# Altium schematic sheet Step Down.schdoc
size 223 x 139 mm; SheetNumber: 1; SheetTotal: 1
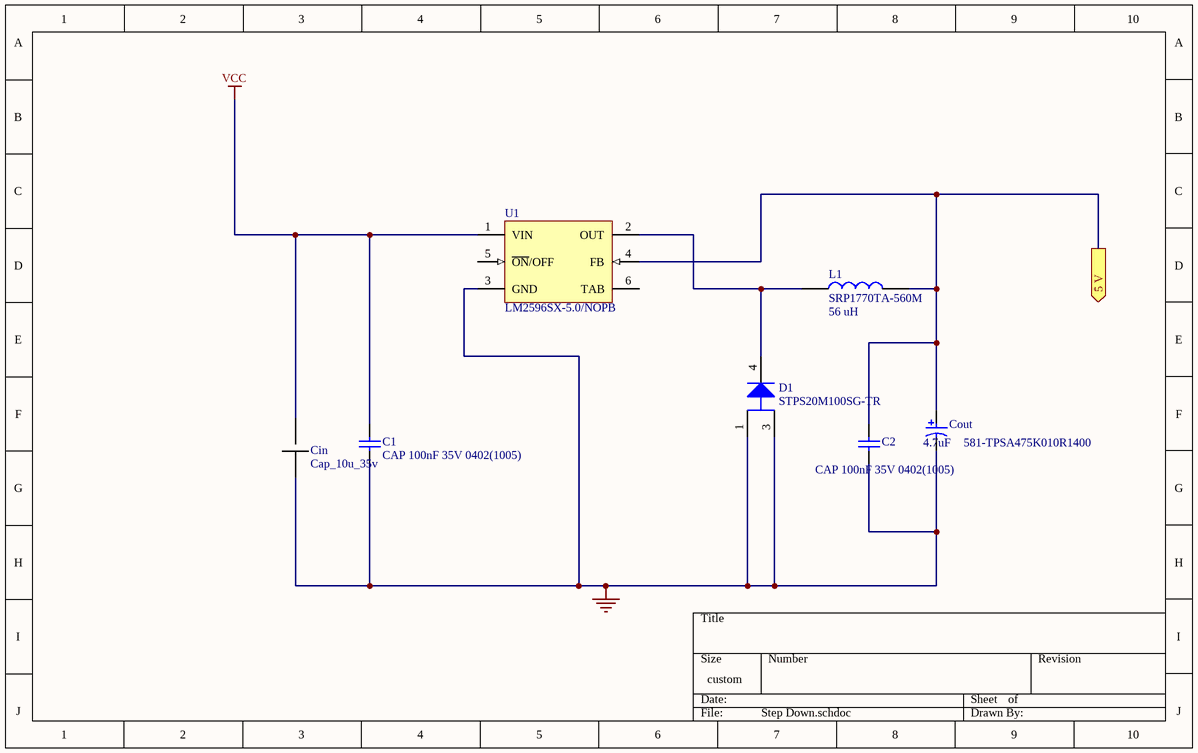
[diagram p0: Step Down.schdoc]

## Parts
C1  CAP 100nF 35V 0402(1005)  [CAPC0402(1005)60_N]
C2  CAP 100nF 35V 0402(1005)  [CAPC0402(1005)60_N]
Cin  Cap_10u_35v  [CAP POL 2917/7343]
Cout  581-TPSA475K010R1400  Capacitancia: 4.7uF  [AVX-TAJ-A-2_L]
D1  STPS20M100SG-TR  [ONSC-D2PAK-3-418B-04_J_V]
L1  SRP1770TA-560M  Indutancia: 56 uH  [INDPM173169X700N]
U1  LM2596SX-5.0/NOPB  [TS5B_M]

## Ports
5 V (out)

## Nets
0: C1.1 C2.1 Cin.1 Cout.2 D1.1(A) D1.3(A) U1.3(GND)
VCC: C1.2 Cin.2 U1.1(VIN)
5 V: C2.2 Cout.1 L1.2 U1.4(FB) ; port 5 V
NetD1_4: D1.4(K) L1.1 U1.2(OUT)

Not connected (* = marked no-connect by the designer): U1 5(~{ON}/OFF) 6(TAB)

## Library data of the parts
C1 = CMP-1034-02076-1: CAP 100nF 35V ±20% 0402 (1005 Metric) Thickness 0.6mm SMD                                                  963-GMK105BJ104MV-F; Case-Metric: 1005; Tolerance: Â±20%; Case-EIA: 0402; Rated Voltage: 35 V; Max Thickness: 0.6 mm; Value: 100nF; Technology: SMT
C2 = CMP-1034-02076-1: CAP 100nF 35V ±20% 0402 (1005 Metric) Thickness 0.6mm SMD                                                 963-GMK105BJ104MV-F; Case-Metric: 1005; Tolerance: Â±20%; Case-EIA: 0402; Rated Voltage: 35 V; Max Thickness: 0.6 mm; Value: 100nF; Technology: SMT
Cin = Cap_10u_35v: 80-T491D106M35AT7280
Cout = CMP-2100-03687-1: Standard Tantalum, 4.7 uF, +/- 10%, 10 V, -55 to 125 degC, 2-Pin SMD (1206), RoHS, Tape and Reel     581-TPSA475K010R1400; Manufacturer: AVX; Dissipation Factor: 6%; Voltage Rating: 10V; Polarity: Polar; Resistance: 4Ohm; Leakage Current: 800nA; Lead Free: LeadFree; Radiation Hardening: No; Depth: 1.6mm; Package Description: 2-Pin Surface Mount Device, Body 3.2 x 1.65 mm; Package Quantity: 1; Max Operating Temperature: 125degC; Case/Package: 1206; Min Operating Temperature: -55degC; Datasheet URL: https://br.mouser.com/datasheet/2/40/tps-776850.pdf; Termination: SMD/SMT; Length: 3.2mm; Height - Seated (Max): 0.071inch; Packaging: TapeandReel; Package Reference: TPS-A-475; RoHSCompliant: True; Datasheet Version: 42401.0; Voltage Rating (DC): 10V; REACH SVHC: NoSVHC; ESR (Equivalent Series Resistance): 4Ohm; Tolerance: 10%; Case Code (Metric): 3216; Voltage: 10V; Height: 1.6mm; Number of Pins: 2; Lead Pitch: 1.1mm; Dielectric Material: Tantalum; Case Code (Imperial): 1206; Width: 1.6mm; Capacitance: 4.7uF
D1 = CMP-1055-00080-1: SWITCHMODE(TM) Power Rectifier ORing Function Diode, 3-Pin D2PAK, Tape and Reel; Manufacturer: On Semiconductor; Configuration: Single; IFSM Max (A): 150; Voltagem: 455mV; PartNumber: STPS20M100SG-TR; PackageReference: D2PAK-3-418B-04_J; DatasheetVersion: Rev. 6; ComponentLink2URL: http://www.onsemi.cn/pub_link/Collateral/MBRB2515L-D.PDF; RoHS: FALSE; ComponentLink2Description: Datasheet; PackageDescription: 3-Pin D2PAK, Body 9.145 x 9.97 mm, Pitch 2.54 mm; ComponentLink1URL: http://www.onsemi.com/; Mounting Technology: Surface Mount; ComponentLink3Description: Package Specification; Packing: Tape and Reel; PackageVersion: Rev. J, 08/2004; ComponentLink1Description: Manufacturer URL; ComponentLink3URL: http://www.onsemi.com/pub_link/Collateral/BUB323Z-D.PDF
L1 = SRP1770TA-560M: Shielded Power Inductor SMD 56uH Bourns SRP1770TA Series Shielded Wire-wound SMD Inductor with a Carbonyl Powder Core, 56 H Wire-Wound 7.8A Idc Q:20; Geometry.Height: 7mm; Manufacturer_Part_Number: SRP1770TA-560M; RS Part Number: 9054781; RS Price/Stock: http://uk.rs-online.com/web/p/products/9054781; Arrow Part Number: SRP1770TA-560M; Arrow Price/Stock: https://www.arrow.com/en/products/srp1770ta-560m/bourns; Datasheet Link: http://docs-europe.electrocomponents.com/webdocs/1465/0900766b81465c8d.pdf; Manufacturer_Name: Bourns
U1 = CMP-0069-00282-2: SIMPLE SWITCHER® Power Converter 150 KHz 3A Step-Down Voltage Regulator, 5-pin TO-263; Manufacturer: Texas Instruments; PowerWise: N; PackageTopMarking: NSUZXYTTE#*LM2596S*-5.0 P+; RevisionNote: Component URLs added; ComponentLink3URL: http://www.national.com/packaging/folders/ts5b.html; Code_JEDEC: MO-169-AB; ComponentLink1Description: LM2596 Datasheet; DatasheetVersion: May-2002; ComponentLink2Description: LM2596 Web Page; PackageReference: TS5B; PackageDescription: TO-263, Molded, .400 x .390 x .180in, 5 Lead, .067in Pitch, Surface Mount; CompType: Switcher; ComponentLink1URL: http://www.national.com/ds/LM/LM2596.pdf; ComponentLink3Description: TS5B Package Page; PinCount: 5; RoHS: N; ComponentLink2URL: http://www.national.com/pf/LM/LM2596.html